# Altium project T9.PrjPcb
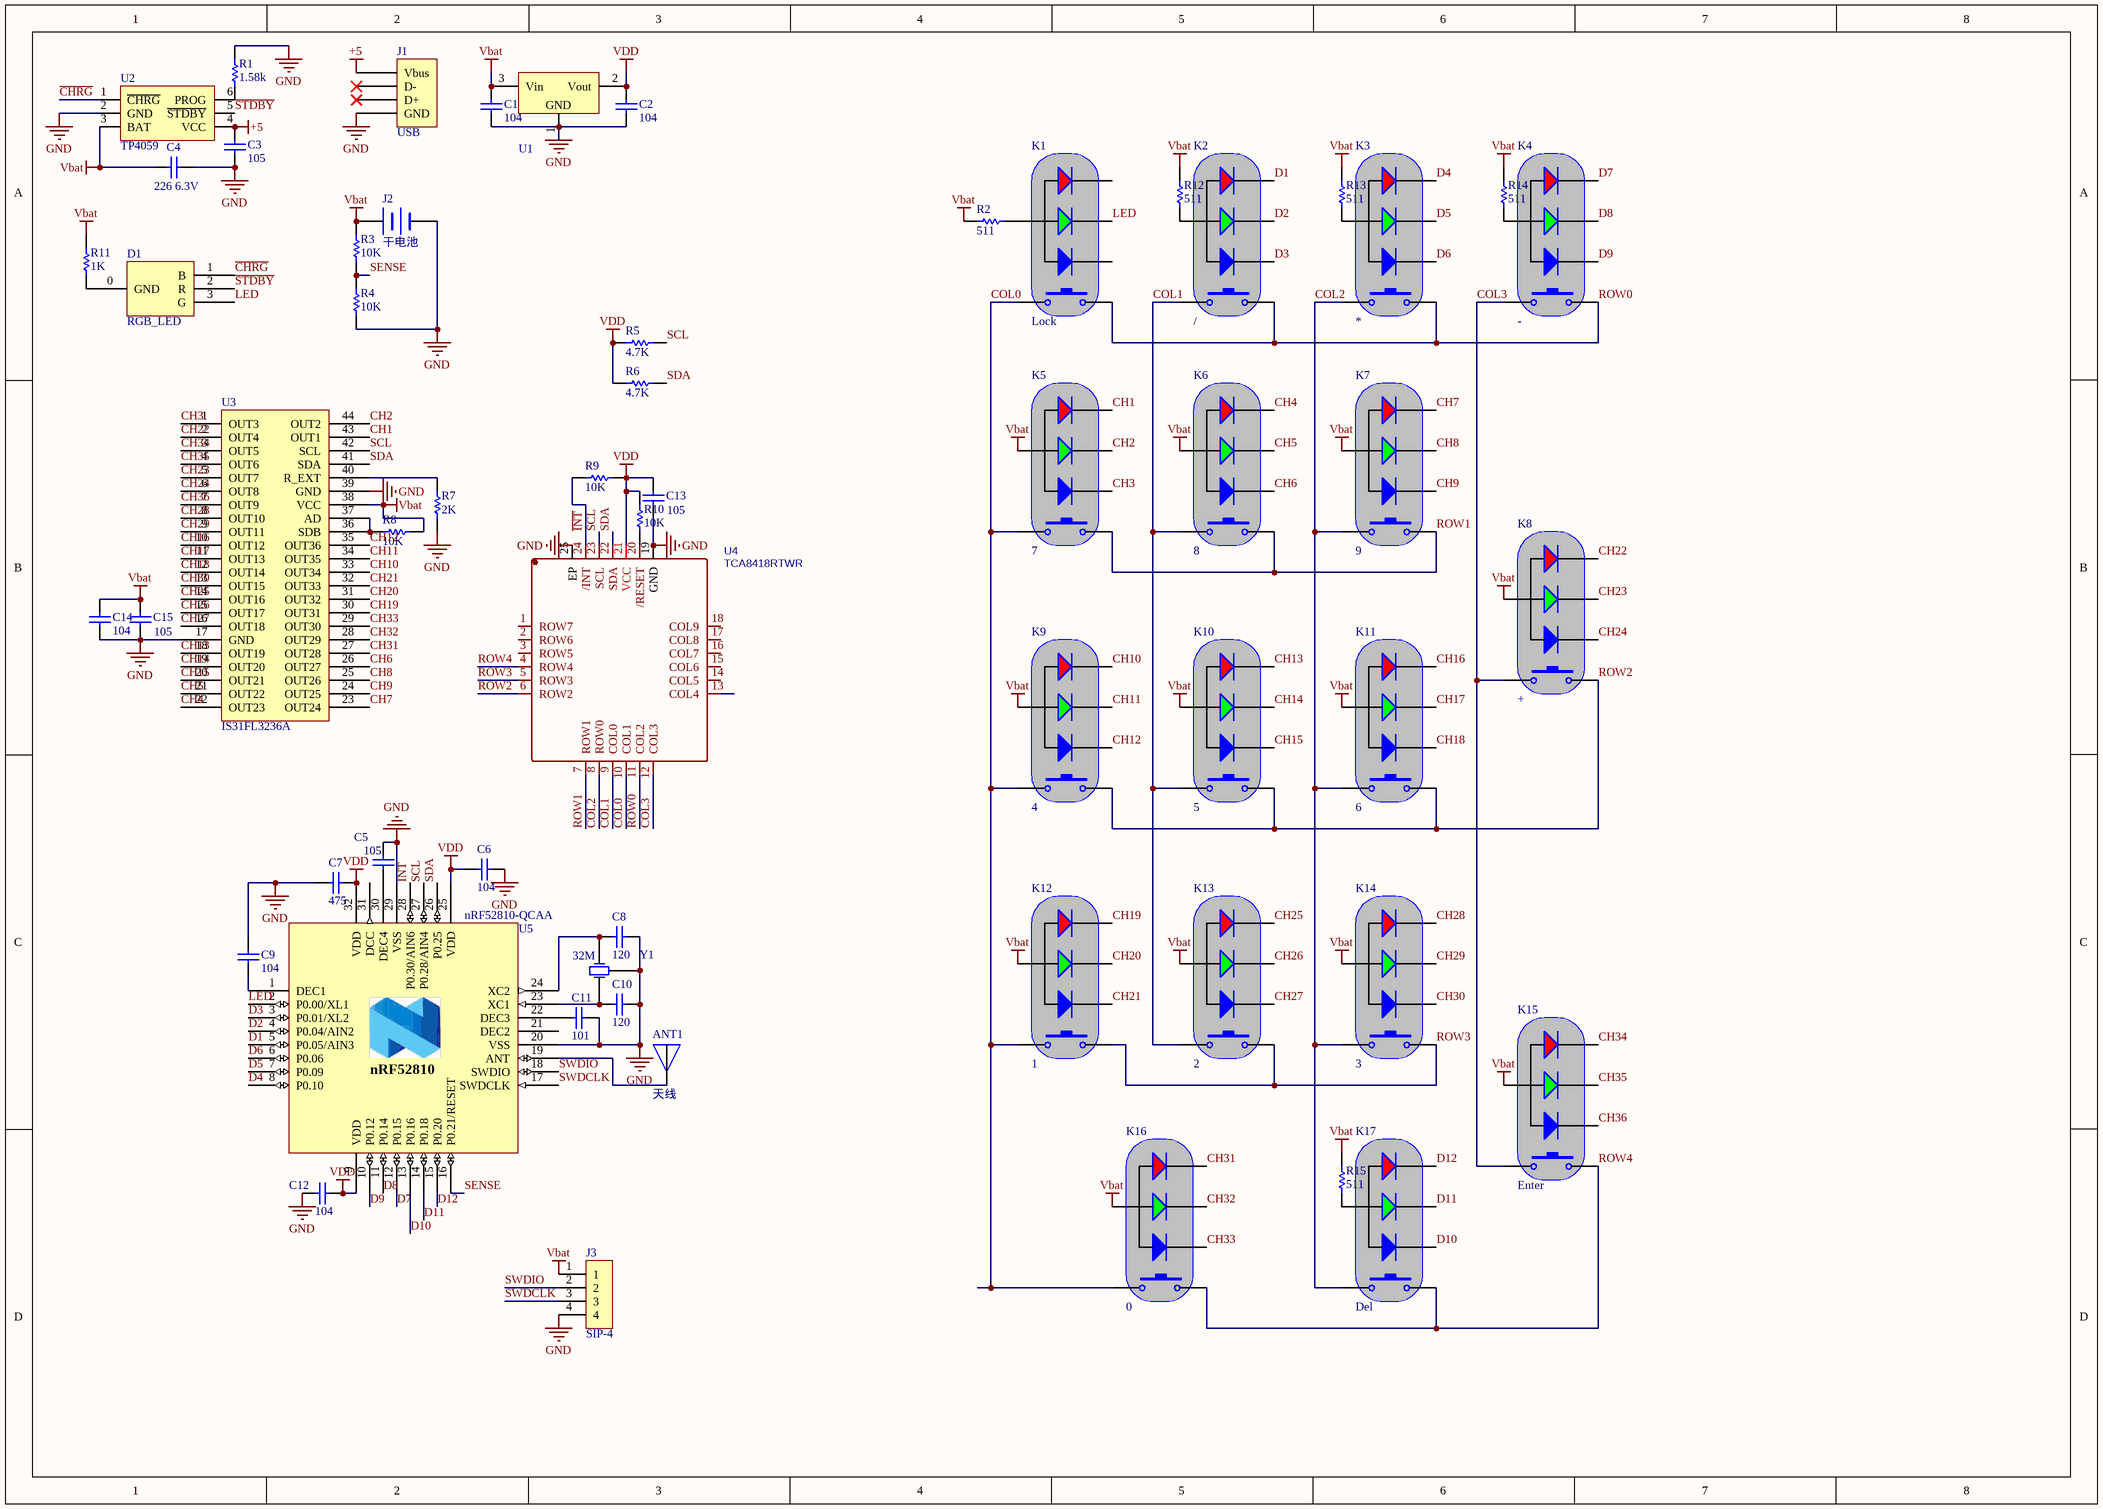
[diagram p0: 原理图.SchDoc]
嘉立创: TRUE; 雕刻机: FALSE
1 sheet, 58 parts. Net scope: global (net labels, ports and power ports of the same name join across sheets).
Board file: 打样.PcbDoc

## Sheet 原理图.SchDoc
size A3

### Parts
ANT1  天线  [ANT]
C1  104  [C0603]
C2  104  [C0603]
C3  105  [C0603]
C4  226 6.3V  [C0603]
C5  105  [C0603]
C6  104  [C0402]
C7  475  [C0603]
C8  120  [C0402]
C9  104  [C0402]
C10  120  [C0402]
C11  101  [C0402]
C12  104  [C0402]
C13  105  [C0603]
C14  104  [C0603]
C15  105  [C0603]
D1  RGB_LED  [LED-SMD-1.6X1.5X0.6-YX3(4P)]
J1  USB  [MICRO-USB-2]
J2  干电池  [18650]
J3  SIP-4  [XH2.54-4AB]
K1  Lock  [Key5RGB]
K2  /  [Key5RGB]
K3  *  [Key5RGB]
K4  -  [Key5RGB]
K5  7  [Key5RGB]
K6  8  [Key5RGB]
K7  9  [Key5RGB]
K8  +  [Key5RGB]
K9  4  [Key5RGB]
K10  5  [Key5RGB]
K11  6  [Key5RGB]
K12  1  [Key5RGB]
K13  2  [Key5RGB]
K14  3  [Key5RGB]
K15  Enter  [Key5RGB]
K16  0  [Key5RGB]
K17  Del  [Key5RGB]
R1  1.58k  [R0402]
R2  511  [R0603]
R3  10K  [R0603]
R4  10K  [R0603]
R5  4.7K  [R0603]
R6  4.7K  [R0603]
R7  2K  [R0805]
R8  10K  [R0805]
R9  10K  [R0402]
R10  10K  [R0402]
R11  1K  [R0603]
R12  511  [R0603]
R13  511  [R0603]
R14  511  [R0603]
R15  511  [R0603]
U1  AMS1117-3V3  [SOT-23]  (value not drawn)
U2  TP4059  [SOT-23-6]
U3  IS31FL3236A  [QFN-44-5X5MM-0.4PITCH]
U4  TCA8418RTWR  [WQFN-24-4X4XP0.5MM]
U5  nRF52810-QCAA  [QFN32P500X500X90]
Y1  32M  [OSC_2016]

### Nets
+5: C3.2 J1.1(Vbus) U2.4(VCC)
GND: C1.1 C2.1 C3.1 C4.1 C5.2 C6.2 C7.1 C8.2 C9.2 C10.2 C11.2 C12.1 C13.1 C14.1 C15.1 J1.5(GND) J2.2(-) J3.4 R1.1 R4.1 R7.1 U1.1(GND) U2.2(GND) U3.17(GND) U3.39(GND) U4.19(GND) U4.25(EP) U5.20(VSS) U5.29(VSS) U5.33 Y1.3(OSC2)
Vbat: C1.2 C4.2 C14.2 C15.2 J2.1(+) J3.1 K5.0(A) K6.0(A) K7.0(A) K8.0(A) K9.0(A) K10.0(A) K11.0(A) K12.0(A) K13.0(A) K14.0(A) K15.0(A) K16.0(A) R2.2 R3.2 R8.1 R11.2 R12.1 R13.1 R14.1 R15.1 U1.3(Vin) U2.3(BAT) U3.38(VCC)
VDD: C2.2 C6.1 C7.2 C12.2 C13.2 R5.2 R6.2 R9.2 R10.1 U1.2(Vout) U4.21(VCC) U5.9(VDD) U5.25(VDD) U5.32(VDD)
~{CHRG}: D1.1(B) U2.1(~{CHRG})
~{INT}: R9.1 U4.24(/INT) U5.28(P0.30/AIN6)
~{STDBY}: D1.2(R) U2.5(~{STDBY})
CH1: K5.1(K) U3.43(OUT1)
CH2: K5.2(K) U3.44(OUT2)
CH3: K5.3(K) U3.1(OUT3)
CH4: K6.1(K) U3.22(OUT23)
CH5: K6.2(K) U3.21(OUT22)
CH6: K6.3(K) U3.26(OUT27)
CH7: K7.1(K) U3.23(OUT24)
CH8: K7.2(K) U3.25(OUT26)
CH9: K7.3(K) U3.24(OUT25)
CH10: K9.1(K) U3.33(OUT34)
CH11: K9.2(K) U3.34(OUT35)
CH12: K9.3(K) U3.35(OUT36)
CH13: K10.1(K) U3.18(OUT19)
CH14: K10.2(K) U3.19(OUT20)
CH15: K10.3(K) U3.20(OUT21)
CH16: K11.1(K) U3.10(OUT12)
CH17: K11.2(K) U3.11(OUT13)
CH18: K11.3(K) U3.12(OUT14)
CH19: K12.1(K) U3.30(OUT31)
CH20: K12.2(K) U3.31(OUT32)
CH21: K12.3(K) U3.32(OUT33)
CH22: K8.1(K) U3.2(OUT4)
CH23: K8.2(K) U3.5(OUT7)
CH24: K8.3(K) U3.6(OUT8)
CH25: K13.1(K) U3.14(OUT16)
CH26: K13.2(K) U3.15(OUT17)
CH27: K13.3(K) U3.16(OUT18)
CH28: K14.1(K) U3.8(OUT10)
CH29: K14.2(K) U3.9(OUT11)
CH30: K14.3(K) U3.13(OUT15)
CH31: K16.1(K) U3.27(OUT28)
CH32: K16.2(K) U3.28(OUT29)
CH33: K16.3(K) U3.29(OUT30)
CH34: K15.1(K) U3.3(OUT5)
CH35: K15.2(K) U3.4(OUT6)
CH36: K15.3(K) U3.7(OUT9)
COL0: K1.4 K5.4 K9.4 K12.4 K16.4 U4.10(COL1)
COL1: K2.4 K6.4 K10.4 K13.4 U4.9(COL0)
COL2: K3.4 K7.4 K11.4 K14.4 K17.4 U4.8(ROW0)
COL3: K4.4 K8.4 K15.4 U4.12(COL3)
D1: K2.1(K) U5.5(P0.05/AIN3)
D2: K2.2(K) U5.4(P0.04/AIN2)
D3: K2.3(K) U5.3(P0.01/XL2)
D4: K3.1(K) U5.8(P0.10)
D5: K3.2(K) U5.7(P0.09)
D6: K3.3(K) U5.6(P0.06)
D7: K4.1(K) U5.12(P0.15)
D8: K4.2(K) U5.11(P0.14)
D9: K4.3(K) U5.10(P0.12)
D10: K17.3(K) U5.13(P0.16)
D11: K17.2(K) U5.14(P0.18)
D12: K17.1(K) U5.15(P0.20)
LED: D1.3(G) K1.2(K) U5.2(P0.00/XL1)
ROW0: K1.5 K2.5 K3.5 K4.5 U4.11(COL2)
ROW1: K5.5 K6.5 K7.5 U4.7(ROW1)
ROW2: K8.5 K9.5 K10.5 K11.5 U4.6(ROW2)
ROW3: K12.5 K13.5 K14.5 U4.5(ROW3)
ROW4: K15.5 K16.5 K17.5 U4.4(ROW4)
SCL: R5.1 U3.42(SCL) U4.23(SCL) U5.27(P0.28/AIN4)
SDA: R6.1 U3.41(SDA) U4.22(SDA) U5.26(P0.25)
SENSE: R3.1 R4.2 U5.16(P0.21/RESET)
SWDCLK: J3.3 U5.17(SWDCLK)
SWDIO: J3.2 U5.18(SWDIO)
NetANT1_1: ANT1.1 U5.19(ANT)
NetC5_1: C5.1 U5.30(DEC4)
NetC8_1: C8.1 U5.24(XC2) Y1.2(OSC2)
NetC9_1: C9.1 U5.1(DEC1)
NetC10_1: C10.1 U5.23(XC1) Y1.1(OSC1)
NetC11_1: C11.1 U5.22(DEC3)
NetD1_0: D1.0(GND) R11.1
NetK1_0: K1.0(A) R2.1
NetK2_0: K2.0(A) R12.2
NetK3_0: K3.0(A) R13.2
NetK4_0: K4.0(A) R14.2
NetK17_0: K17.0(A) R15.2
NetR1_2: R1.2 U2.6(PROG)
NetR7_2: R7.2 U3.40(R_EXT)
NetR8_2: R8.2 U3.36(SDB) U3.37(AD)
NetR10_2: R10.2 U4.20(/RESET)

Not connected (* = marked no-connect by the designer): J1 2(D-)* 3(D+)*; K1 1(K) 3(K); U4 1(ROW7) 2(ROW6) 3(ROW5) 13(COL4) 14(COL5) 15(COL6) 16(COL7) 17(COL8) 18(COL9); U5 21(DEC2) 31(DCC)

### Notes on the sheet
- Title
- Size:
- Date:
- A4
- Number:
- Time:
- Revision:
- Sheet
- of
- File:
- (in symbol nRF52810_QCAA) nRF52810

### Library data of the parts
C1-C15 = 电容: Capacitor; Value: 22pF; Published: 8-Jun-2000; LatestRevisionDate: 17-Jul-2002; LatestRevisionNote: Re-released for DXP Platform.; PackageReference: RAD-0.3; Publisher: Altium Limited; PackageDescription: Radial Cap, Thru-Hole; 2 Leads; 0.3 in Pin Spacing
J2 = 干电池: Battery
K1-K17 = Key5RGB
R1-R15 = 电阻: Resistor; Value: 150R; Published: 8-Jun-2000; LatestRevisionDate: 17-Jul-2002; LatestRevisionNote: Re-released for DXP Platform.; PackageReference: AXIAL-0.3; Publisher: Altium Limited; PackageDescription: Axial Device, Thru-Hole; 2 Leads; 0.3 in Pin Spacing
U1 = 三端稳压: 三端稳压芯片; BOM名称: 稳压芯片; 版权归属: 源创客; 学习资源: www.ooocke.com
U3 = FL3236: 36 CHANNEL LED DRIVER
U4 = TCA8418: BOM_Manufacturer: Texas Instruments; Contributor: LCSC; BOM_Supplier: LCSC; BOM_Supplier Part: C138713; BOM_Manufacturer Part: TCA8418RTWR; spicePre: U; spiceSymbolName: TCA8418RTWR
U5 = nRF52810_QCAA: Multi-protocol Bluetooth Low Energy, ANT and 2.4GHz proprietary system-on-chip; Manufacturer: Nordic Semiconductor; Note: nRF52810 - QFN32 5x5 0.5mm pitch; Part Number: nRF52810-QCAA; Manufacturer Part Number: nRF52810-QCAA; LatestRevisionDate: 2017-08-21; Pin Count: 32; Publisher: Nordic Semiconductor; Published: 2017-08-21; Value: nRF52810-QCAA; Footprint Doc: QFN-32
Y1 = XTAL_3Pin